# EAGLE schematic TapTempo (EAGLE 7.5.0)

## Sheet 1 of 2
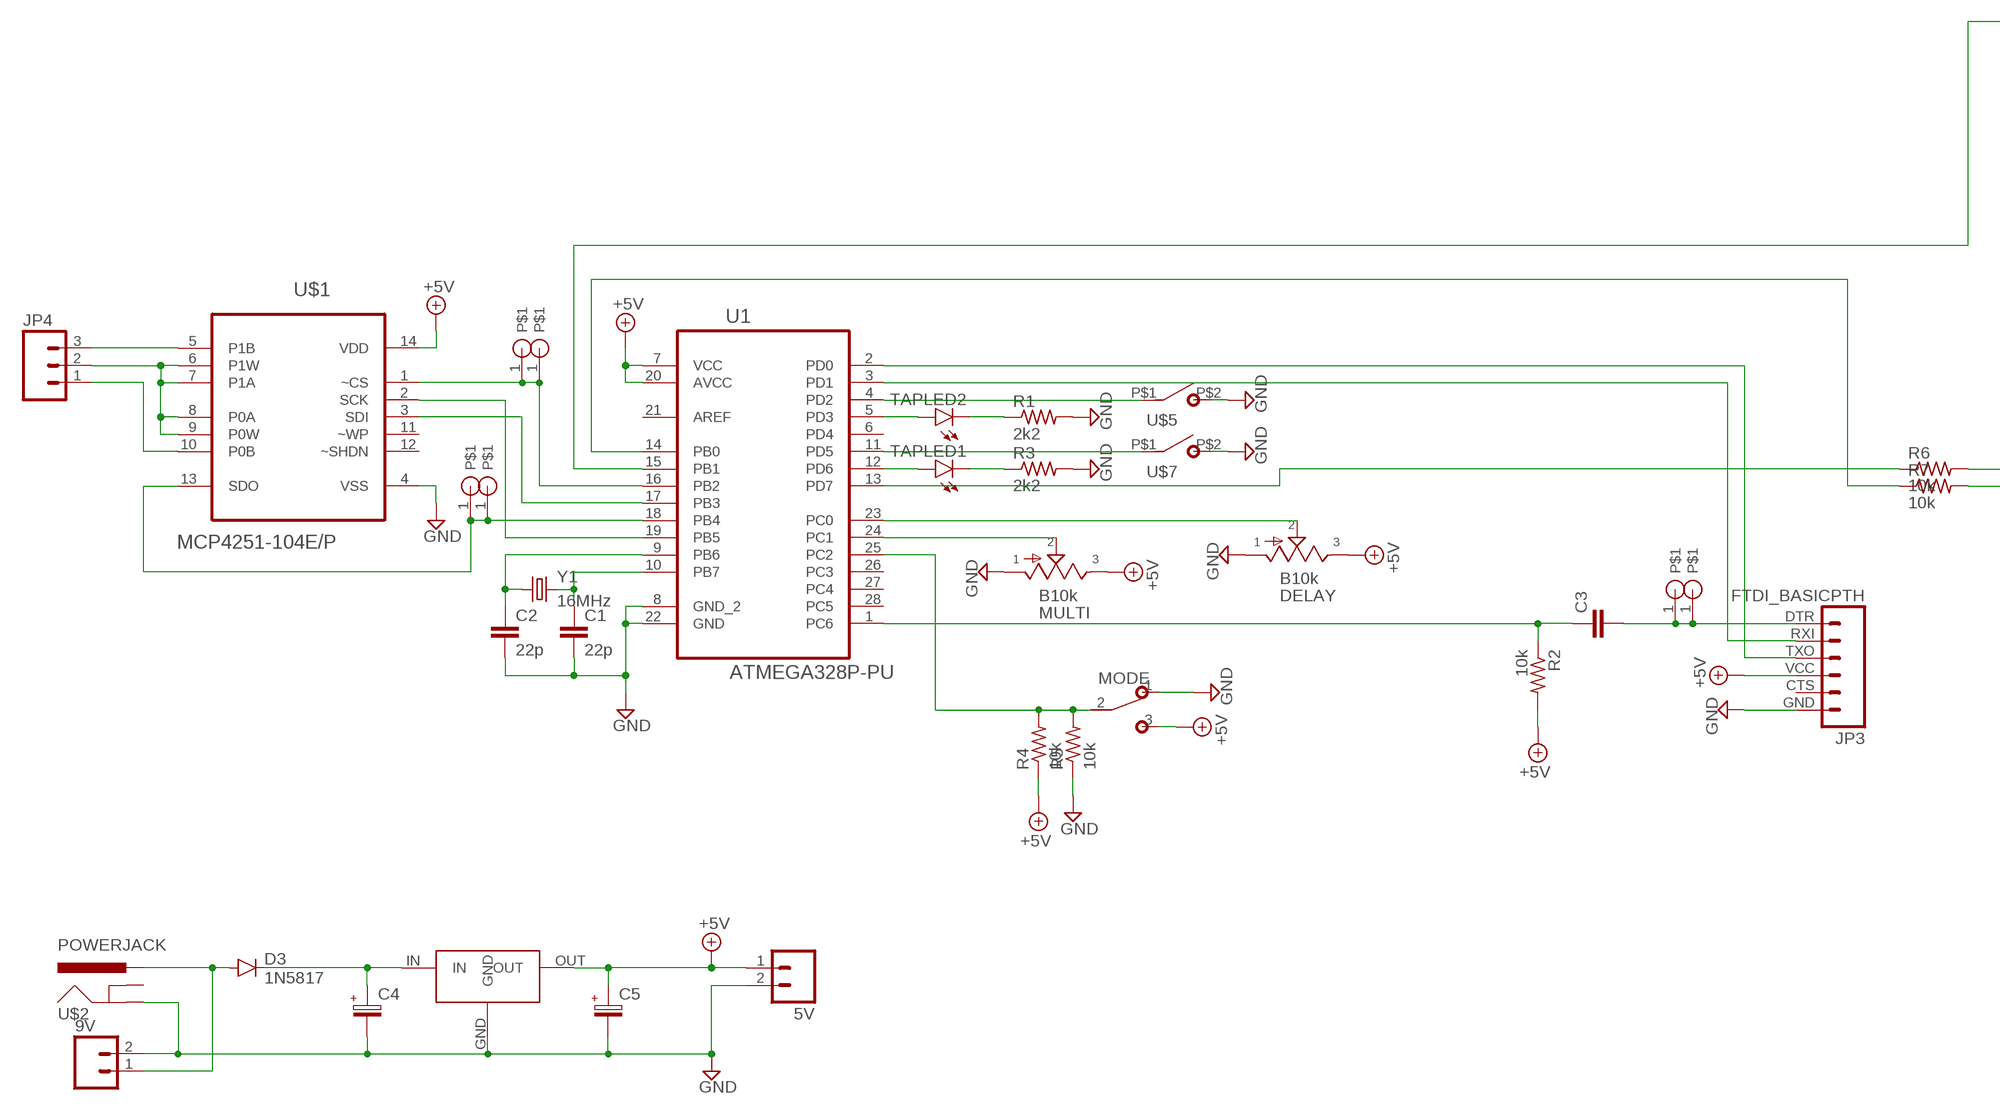
[diagram p0: schematic, sheet 1, part 1 of 2]
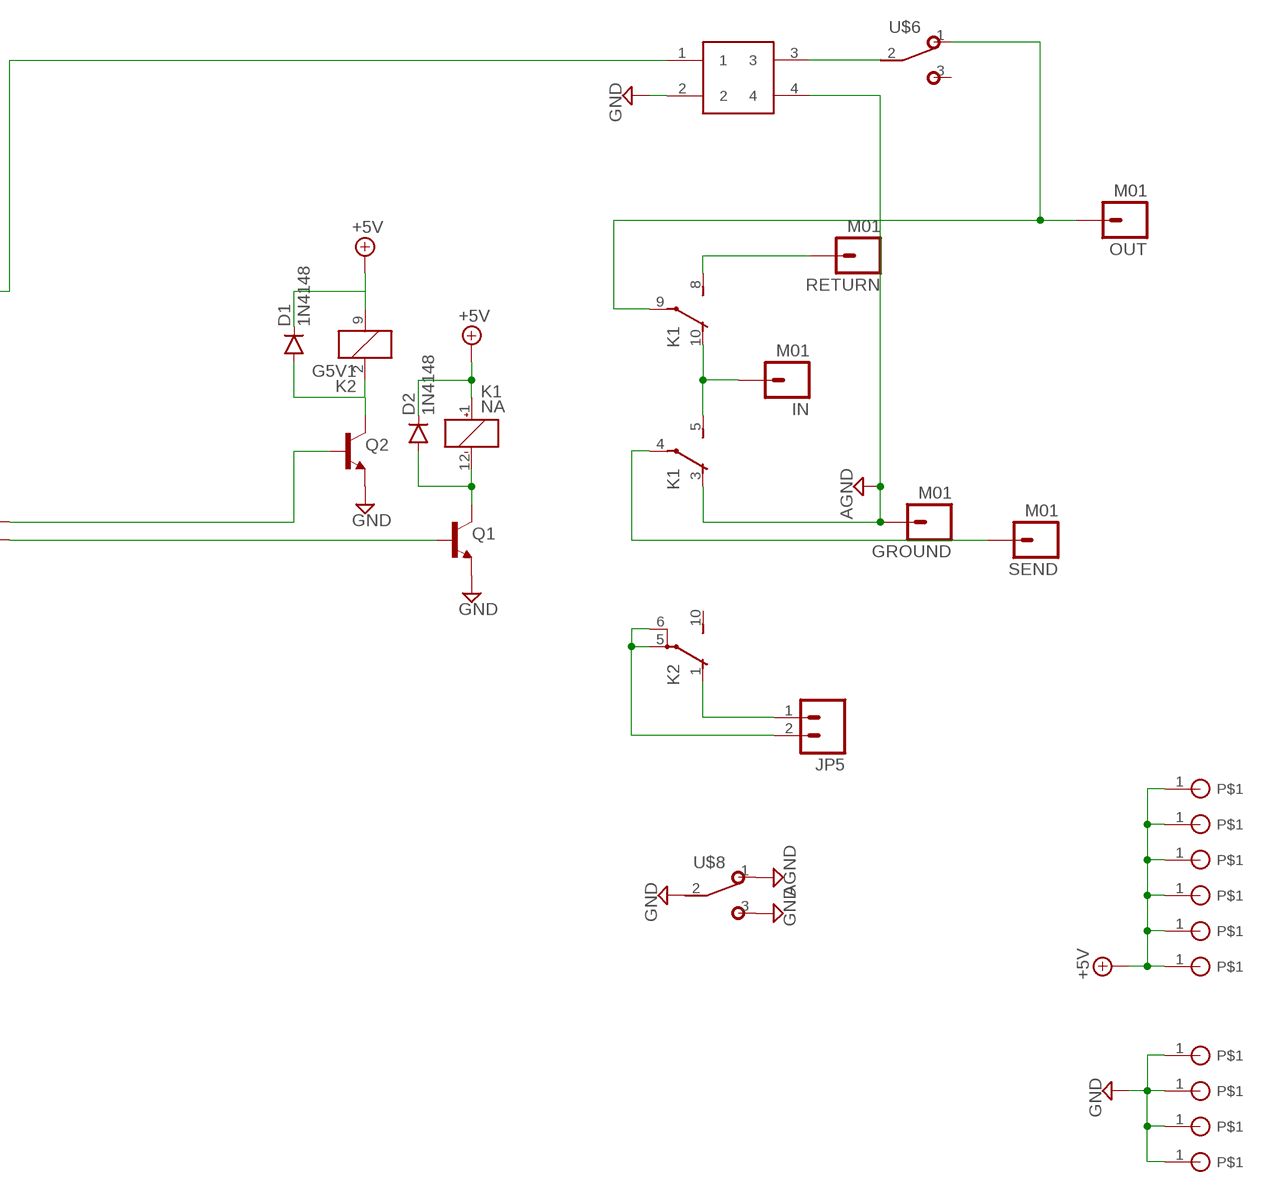
[diagram p1: schematic, sheet 1, part 2 of 2]

### Parts
5V  M02PTH  [1X02]
9V  M02PTH  [1X02]
C1  22p  CAPACITORCERAMIC2,5  [PITCH_2,5]
C2  22p  CAPACITORCERAMIC2,5  [PITCH_2,5]
C3  CAPACITORW2.5  [W2.5]
C4  CAP_POLD6,3  [POL_D6,3]
C5  CAP_POLD6,3  [POL_D6,3]
D1  1N4148  DIODE1N4148  [DIODE-1N4148]
D2  1N4148  DIODE1N4148  [DIODE-1N4148]
D3  1N5817  DIODEPTH  [DIODE-1N4001]
DELAY  B10k  POT_ANGLED  [16MM]
GROUND  M01  [1X01]
IN  M01  [1X01]
JP3  FTDI_BASICPTH  [FTDI_BASIC]
JP4  M03PTH  [1X03]
JP5  M02PTH  [1X02]
K1  NA  [NA]
K2  G5V1  [G5V1]
L1  M01_LINK  [1X01]
L2  M01_LINK  [1X01]
L3  M01_LINK  [1X01]
L4  M01_LINK  [1X01]
L5  M01_LINK  [1X01]
L6  M01_LINK  [1X01]
L7  M01_LINK  [1X01]
L8  M01_LINK  [1X01]
L9  M01_LINK  [1X01]
L10  M01_LINK  [1X01]
L11  M01_LINK  [1X01]
L12  M01_LINK  [1X01]
L13  M01_LINK  [1X01]
L14  M01_LINK  [1X01]
L15  M01_LINK  [1X01]
L16  M01_LINK  [1X01]
MODE  TOGGLE-SPDT  [TOGGLE-SPDT]
MULTI  B10k  POT_ANGLED  [16MM]
OUT  M01  [1X01]
Q1  NPN  [TO92]
Q2  NPN  [TO92]
R1  2k2  RESISTORPITCH_3  [R0207/3]
R2  10k  RESISTORPITCH_3  [R0207/3]
R3  2k2  RESISTORPITCH_3  [R0207/3]
R4  10k  RESISTORPITCH_3  [R0207/3]
R5  10k  RESISTORPITCH_3  [R0207/3]
R6  10k  RESISTORPITCH_3  [R0207/3]
R7  10k  RESISTORPITCH_3  [R0207/3]
RETURN  M01  [1X01]
SEND  M01  [1X01]
TAPLED1  LED5MM  [LED5MM]
TAPLED2  LED5MM  [LED5MM]
U1  ATMEGA328P-PU  [DIP254P762X457-28]
U$1  MCP4251-104E/P  [DIP254P762X533-14]
U$2  POWERJACK  [POWER2.1]
U$3  78LXX  [TO92]
U$4  TLP222A  [TLP222A]
U$5  FOOT-SPST_SOFT  [FOOT-SPST_SOFT]
U$6  TOGGLE-SPDTSUB  [SPDT_SUB]
U$7  FOOT-SPST_SOFT  [FOOT-SPST_SOFT]
U$8  TOGGLE-SPDTSUB  [SPDT_SUB]
Y1  16MHz  CRYSTALHC49US  [HC49US]

### Nets
+5V: 5V.1 C5.+ D1.C D2.C DELAY.3 JP3.VCC K1.1(1:+) K2.9 L1.1 L2.1 L13.1 L14.1 L15.1 L16.1 MODE.3 MULTI.3 R2.2 R4.1 U1.7(VCC) U1.20(AVCC) U$1.14(VDD) U$3.OUT
AGND: GROUND.1 K1.3(2:O) U$4.4 U$8.1
GND: 5V.2 9V.2 C1.P$2 C2.P$2 C4.- C5.- DELAY.1 JP3.GND L3.1 L4.1 L11.1 L12.1 MODE.1 MULTI.1 Q1.E Q2.E R1.2 R3.2 R5.1 U1.8(GND_2) U1.22(GND) U$1.4(VSS) U$2.GND U$3.GND U$4.2 U$5.P$2(S) U$7.P$2(S) U$8.2 U$8.3
N$1: C2.P$1 U1.9(PB6) Y1.1
N$2: C1.P$1 U1.10(PB7) Y1.2
N$3: JP4.2 U$1.6(P1W) U$1.7(P1A) U$1.8(P0A) U$1.9(P0W)
N$4: DELAY.2 U1.23(PC0)
N$5: U1.19(PB5) U$1.2(SCK)
N$6: U1.17(PB3) U$1.3(SDI)
N$7: L7.1 L8.1 U1.16(PB2) U$1.1(~CS)
N$8: U1.15(PB1) U$4.1
N$9: TAPLED2.A U1.5(PD3)
N$10: U1.4(PD2) U$5.P$1(P)
N$11: MULTI.2 U1.24(PC1)
N$12: R1.1 TAPLED2.C
N$13: JP4.1 U$1.10(P0B)
N$14: JP4.3 U$1.5(P1B)
N$15: L5.1 L6.1 U1.18(PB4) U$1.13(SDO)
N$16: C3.1 R2.1 U1.1(PC6)
N$17: JP3.TXO U1.2(PD0)
N$18: JP3.RXI U1.3(PD1)
N$19: C3.2 JP3.DTR L9.1 L10.1
N$20: U1.11(PD5) U$7.P$1(P)
N$21: R3.1 TAPLED1.C
N$22: MODE.2 R4.2 R5.2 U1.25(PC2)
N$23: TAPLED1.A U1.12(PD6)
N$24: R6.1 U1.13(PD7)
N$25: Q2.B R6.2
N$26: Q1.B R7.2
N$27: D1.A K2.2 Q2.C
N$28: D2.A K1.12(1:-) Q1.C
N$29: C4.+ D3.C U$3.IN
N$30: R7.1 U1.14(PB0)
N$31: 9V.1 D3.A U$2.VCC(PWR)
N$32: JP5.1 K2.1(2:O)
N$33: JP5.2 K2.5(2:P) K2.6(2:P)
N$34: K1.4(2:P) SEND.1
N$36: K1.8(3:S) RETURN.1
N$37: IN.1 K1.5(2:S) K1.10(3:O)
N$38: K1.9(3:P) OUT.1 U$6.1
N$39: U$4.3 U$6.2
Unconnected: JP3.CTS K2.10(2:S) U1.6(PD4) U1.21(AREF) U1.26(PC3) U1.27(PC4) U1.28(PC5) U$1.11(~WP) U$1.12(~SHDN) U$2.GND_BRK(GNDBREAK) U$6.3

## Sheet 2 of 2

## Library data of the parts
5V 9V JP5 = SparkFun-Connectors:M02: Standard 2-pin 0.1" header. Use with - straight break away headers ( PRT-00116) - right angle break away headers (PRT-00553) - swiss pins (PRT-00743) - machine pins (PRT-00117) - female headers (PRT-00115) Molex polarized connector foot print use with: PRT-08233 with associated crimp pins and housings. 2.54_SCREWTERM for use with PRT-10571. 3.5mm Screw Terminal footprints for PRT-08084 5mm Screw Terminal footprints for use with PRT-08432
C1-C3 = MMPassive:CAPACITOR
C4 C5 = MMPassive:CAP_POL
D1-D3 = MMActive:DIODE: Diode These are standard reverse protection diodes and small signal diodes. SMA package can handle up to about 1A. SOD-323 can handle about 200mA. What the SOD-323 package when ordering, there are some mfgs out there that are 5-pin packages.
DELAY MULTI = MMPots:POT_ANGLED
GROUND IN OUT RETURN SEND = MMConnectors:M01
JP3 = SparkFun-Connectors:FTDI_BASIC: FTDI Basic header with labels
JP4 = SparkFun-Connectors:M03: Header 3 Standard 3-pin 0.1" header. Use with straight break away headers (SKU : PRT-00116), right angle break away headers (PRT-00553), swiss pins (PRT-00743), machine pins (PRT-00117), and female headers (PRT-00115). Molex polarized connector foot print use with SKU : PRT-08232 with associated crimp pins and housings.
K1 = MMRelays:NA: RELAY
K2 = MMRelays:G5V1: RELAY 1 x switch, 0.5 A/125 V AC, 1 A/24 V DC , Omron; MPN: G5V-1-DC24; OC_FARNELL: 9949593; OC_NEWARK: 36M6377
L1-L16 = MMConnectors:M01_LINK
MODE U$6 U$8 = MMSwitches:TOGGLE-SPDT
Q1 Q2 = MMActive:NPN
R1-R7 = MMPassive:RESISTOR
TAPLED1 TAPLED2 = MMLEDs:LED: LEDs Standard schematic elements and footprints for 5mm, 3mm, 1206, and 0603 sized LEDs. 5mm - Spark Fun Electronics SKU : COM-00529 (and others)
U1 = Atmel_By_element14_Batch_1-00:ATMEGA328P-PU: 8-bit Microcontroller with In-System Programmable Flash; MPN: ATMEGA328P-PU; OC_FARNELL: 1715487; OC_NEWARK: 15R0268; PACKAGE: PDIP-28; SUPPLIER: Atmel
U$1 = Microchip_By_element14_Batch_1:MCP4251-104E/P: Digital POT; MPN: MCP4251-104E/P; OC_FARNELL: 1840692; OC_NEWARK: 27M0150; PACKAGE: DIP-14; SUPPLIER: Microchip
U$2 = MMConnectors:POWERJACK
U$3 = MMTransformer:78LXX
U$4 = MMOptocouplers:TLP222A
U$5 U$7 = MMSwitches:FOOT-SPST_SOFT
Y1 = SparkFun-FreqCtrl:CRYSTAL: Various standard crystals. Proven footprints.